# EAGLE design working (EAGLE 6.5.0)
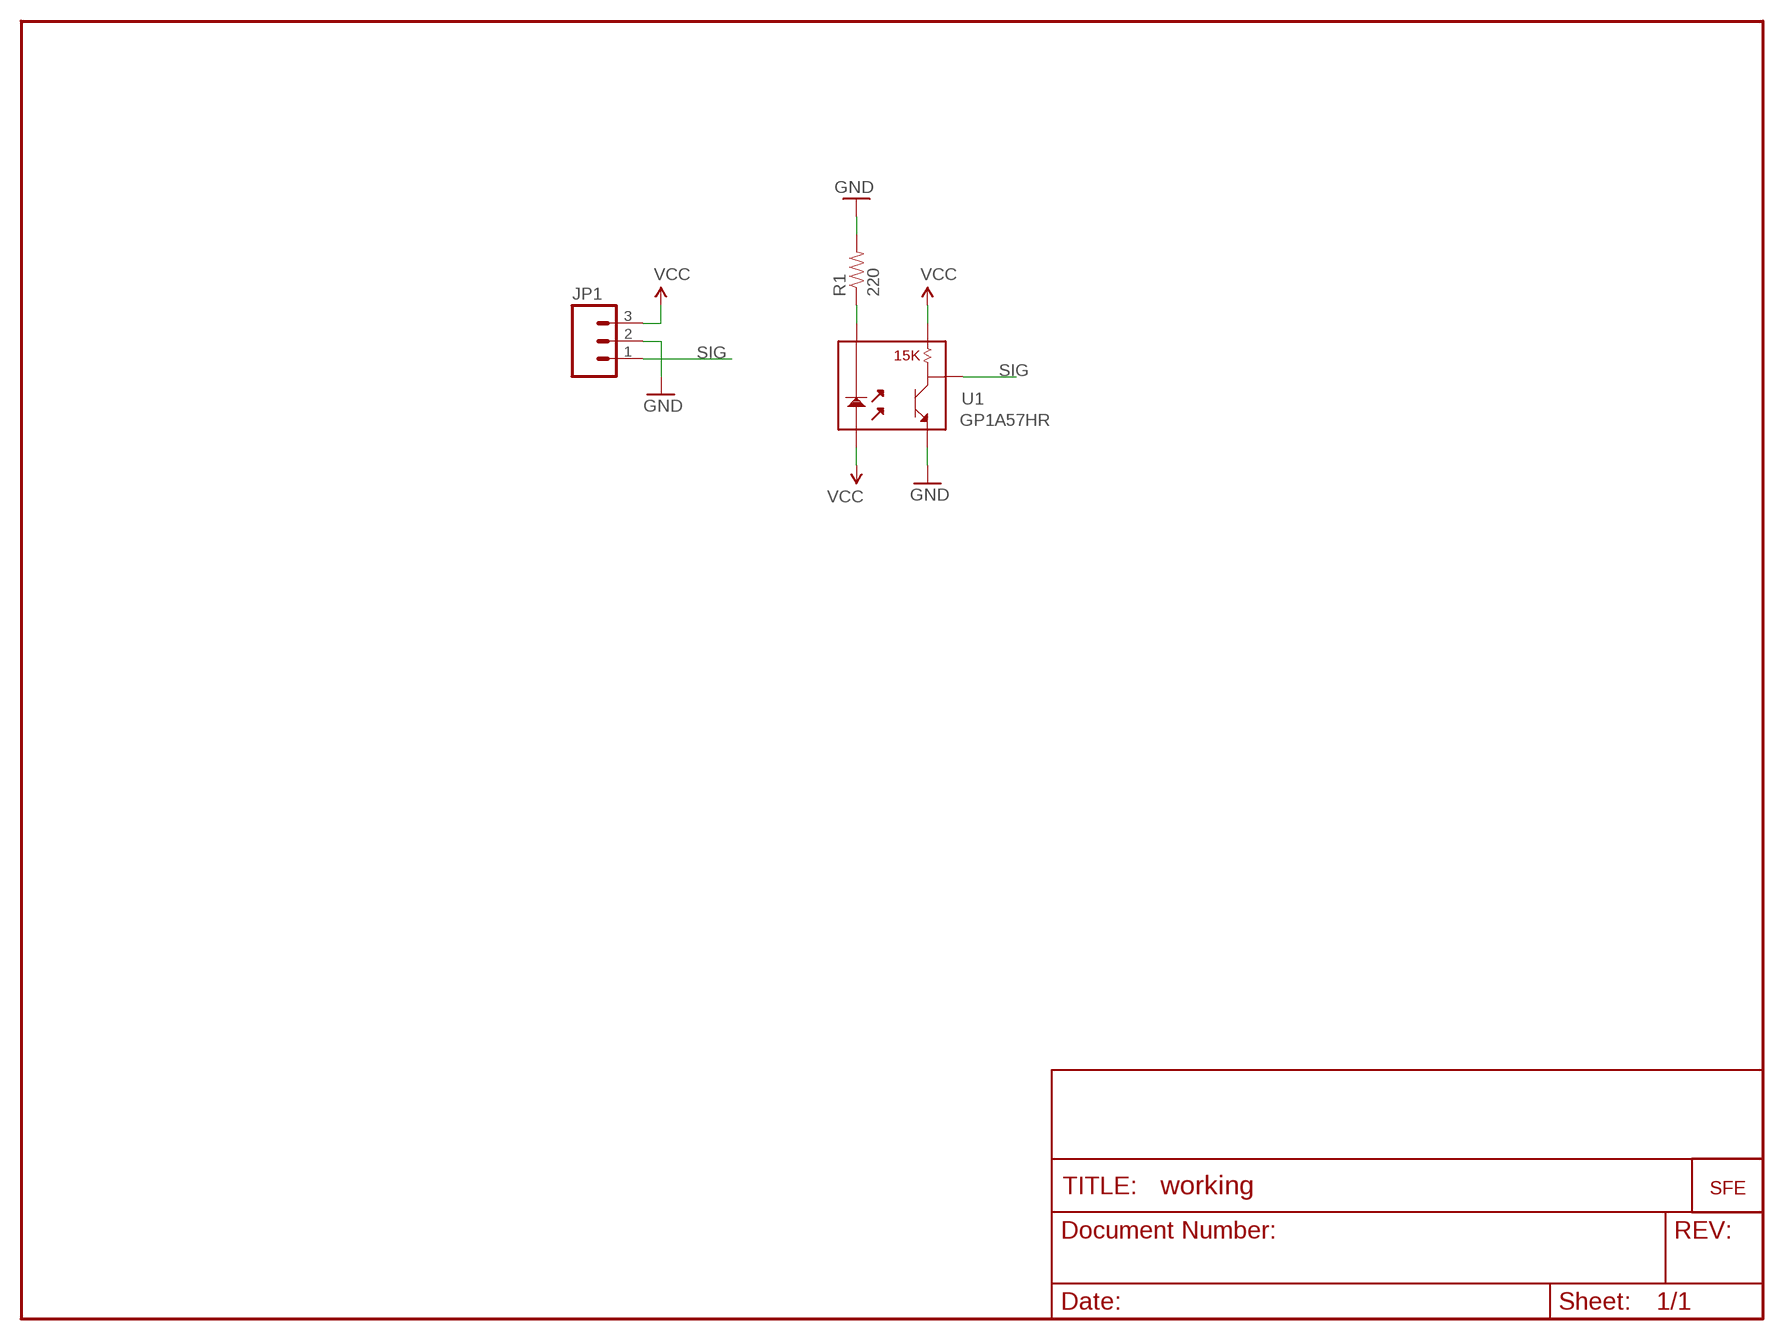
[diagram p0: schematic, sheet 1]

## Parts
JP1  M03PTH  [1X03]
R1  220  RESISTORPTH1  [AXIAL-0.3]
U1  GP1A57HR  [GP1A57HR]
U2  LOGO-SFESK  [SFE-LOGO-FLAME]

## Nets
GND: JP1.2 R1.P$2 U1.5
N$2: R1.P$1 U1.2
SIG: JP1.1 U1.4
VCC: JP1.3 U1.1 U1.3

## Library data of the parts
JP1 = SparkFun:M03: Header 3 Standard 3-pin 0.1" header. Use with straight break away headers (SKU : PRT-00116), right angle break away headers (PRT-00553), swiss pins (PRT-00743), machine pins (PRT-00117), and female headers (PRT-00115). Molex polarized connector foot print use with SKU : PRT-08232 with associated crimp pins and housings.
R1 = SparkFun:RESISTOR: Resistor Basic schematic elements and footprints for 0603, 1206, and PTH 1/10th watt (small) resistors.
U1 = SparkFun:GP1A57HR
U2 = SparkFun:LOGO-SFE: Spark Fun Electronics PCB Logo This is the standard Spark Fun Electronics PCB logo.

## Board
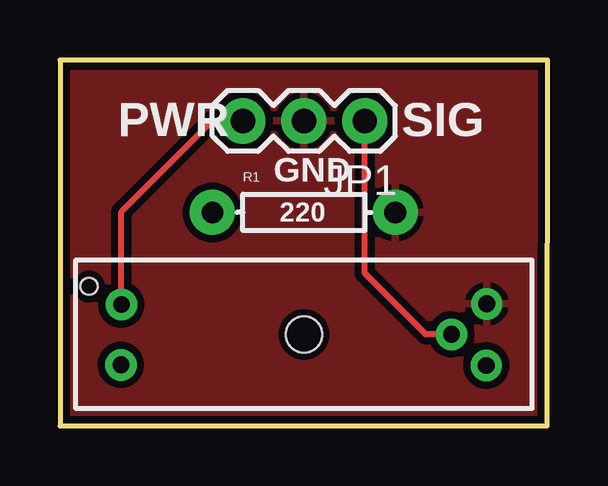
[diagram p1: board, top side]
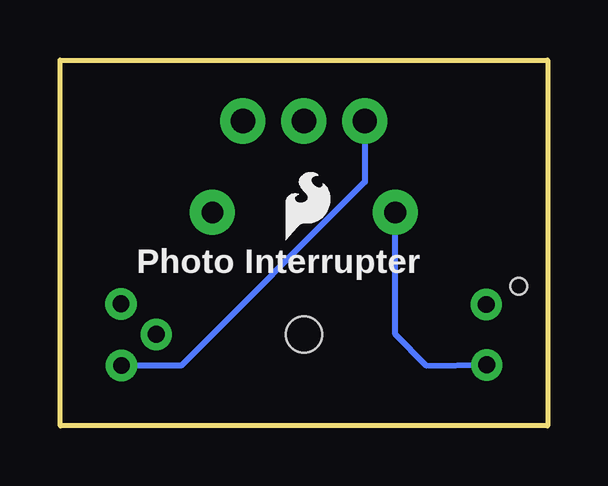
[diagram p2: board, bottom side, seen from below]

Size 20.32 x 15.24 mm. Coordinates in mm from the lower left corner, seen from the top.
Outline: 0,0 20.3,0 20.32,15.24 0,15.24 0,0
Copper layers (1*16): Top 0.0356mm / dielectric 1.5011mm / Bottom 0.0356mm
Design rules "default": minimum track width 8mil, minimum drill 20mil, track to track 8mil, track to pad 8mil, pad to pad 8mil, via to via 8mil, smd to smd 8mil, copper to edge 10mil, drill to drill 8mil, minimum pad ring 12mil, minimum via ring 10mil, stop-mask expansion 4mil, vias tented up to drill 20mil, thermal gap 10mil

### Footprints (pad centres in the part's own frame; a part is rotated, then mirrored left to right if it is on the bottom)
1X03 = drill 1.016 pad 1.88: 1 0,0; 2 2.54,0; 3 5.08,0
AXIAL-0.3 = drill 0.9 pad 1.88: P$1 -3.81,0; P$2 3.81,0
GP1A57HR = drill 0.7: 1 -7.6,1.24; 2 -7.62,-1.27; 3 7.6,-1.3; 4 6.15,0; 5 7.62,1.27 | hole 1.5: 0,0 | hole 0.7: -8.95,2

### Placement (x,y rotation side)
JP1  12.7,12.7 180 top
R1  10.16,8.89 0 top
U1  10.16,3.81 0 top
U2  10.92,7.75 0 bottom

### Tracks (layer width: path | path; a pad name or v marks a point on that pad's centre or on a via)
GND
  pour Top (isolate 0.305): 0,0 20.32,0 20.32,15.24 0,15.24
N$2
  Bottom 0.254: U1.2 5.05,2.51 6.35,3.81 R1.P$1
SIG
  Top 0.254: U1.4 15.24,3.81 12.7,6.35 JP1.1
VCC
  Top 0.254: JP1.3 6.35,12.7 2.56,8.91 U1.1
  Bottom 0.254: U1.3 15.27,2.51 7.62,10.16 JP1.3

### Text on the board
tPlace: PWR | SIG | GND
bPlace: Photo Interrupter